# Altium schematic sheet Đồng Hồ_ Led 7 Thanh_ Duy bánh quy.SchDoc
size A3; SheetNumber: 1; SheetTotal: 4
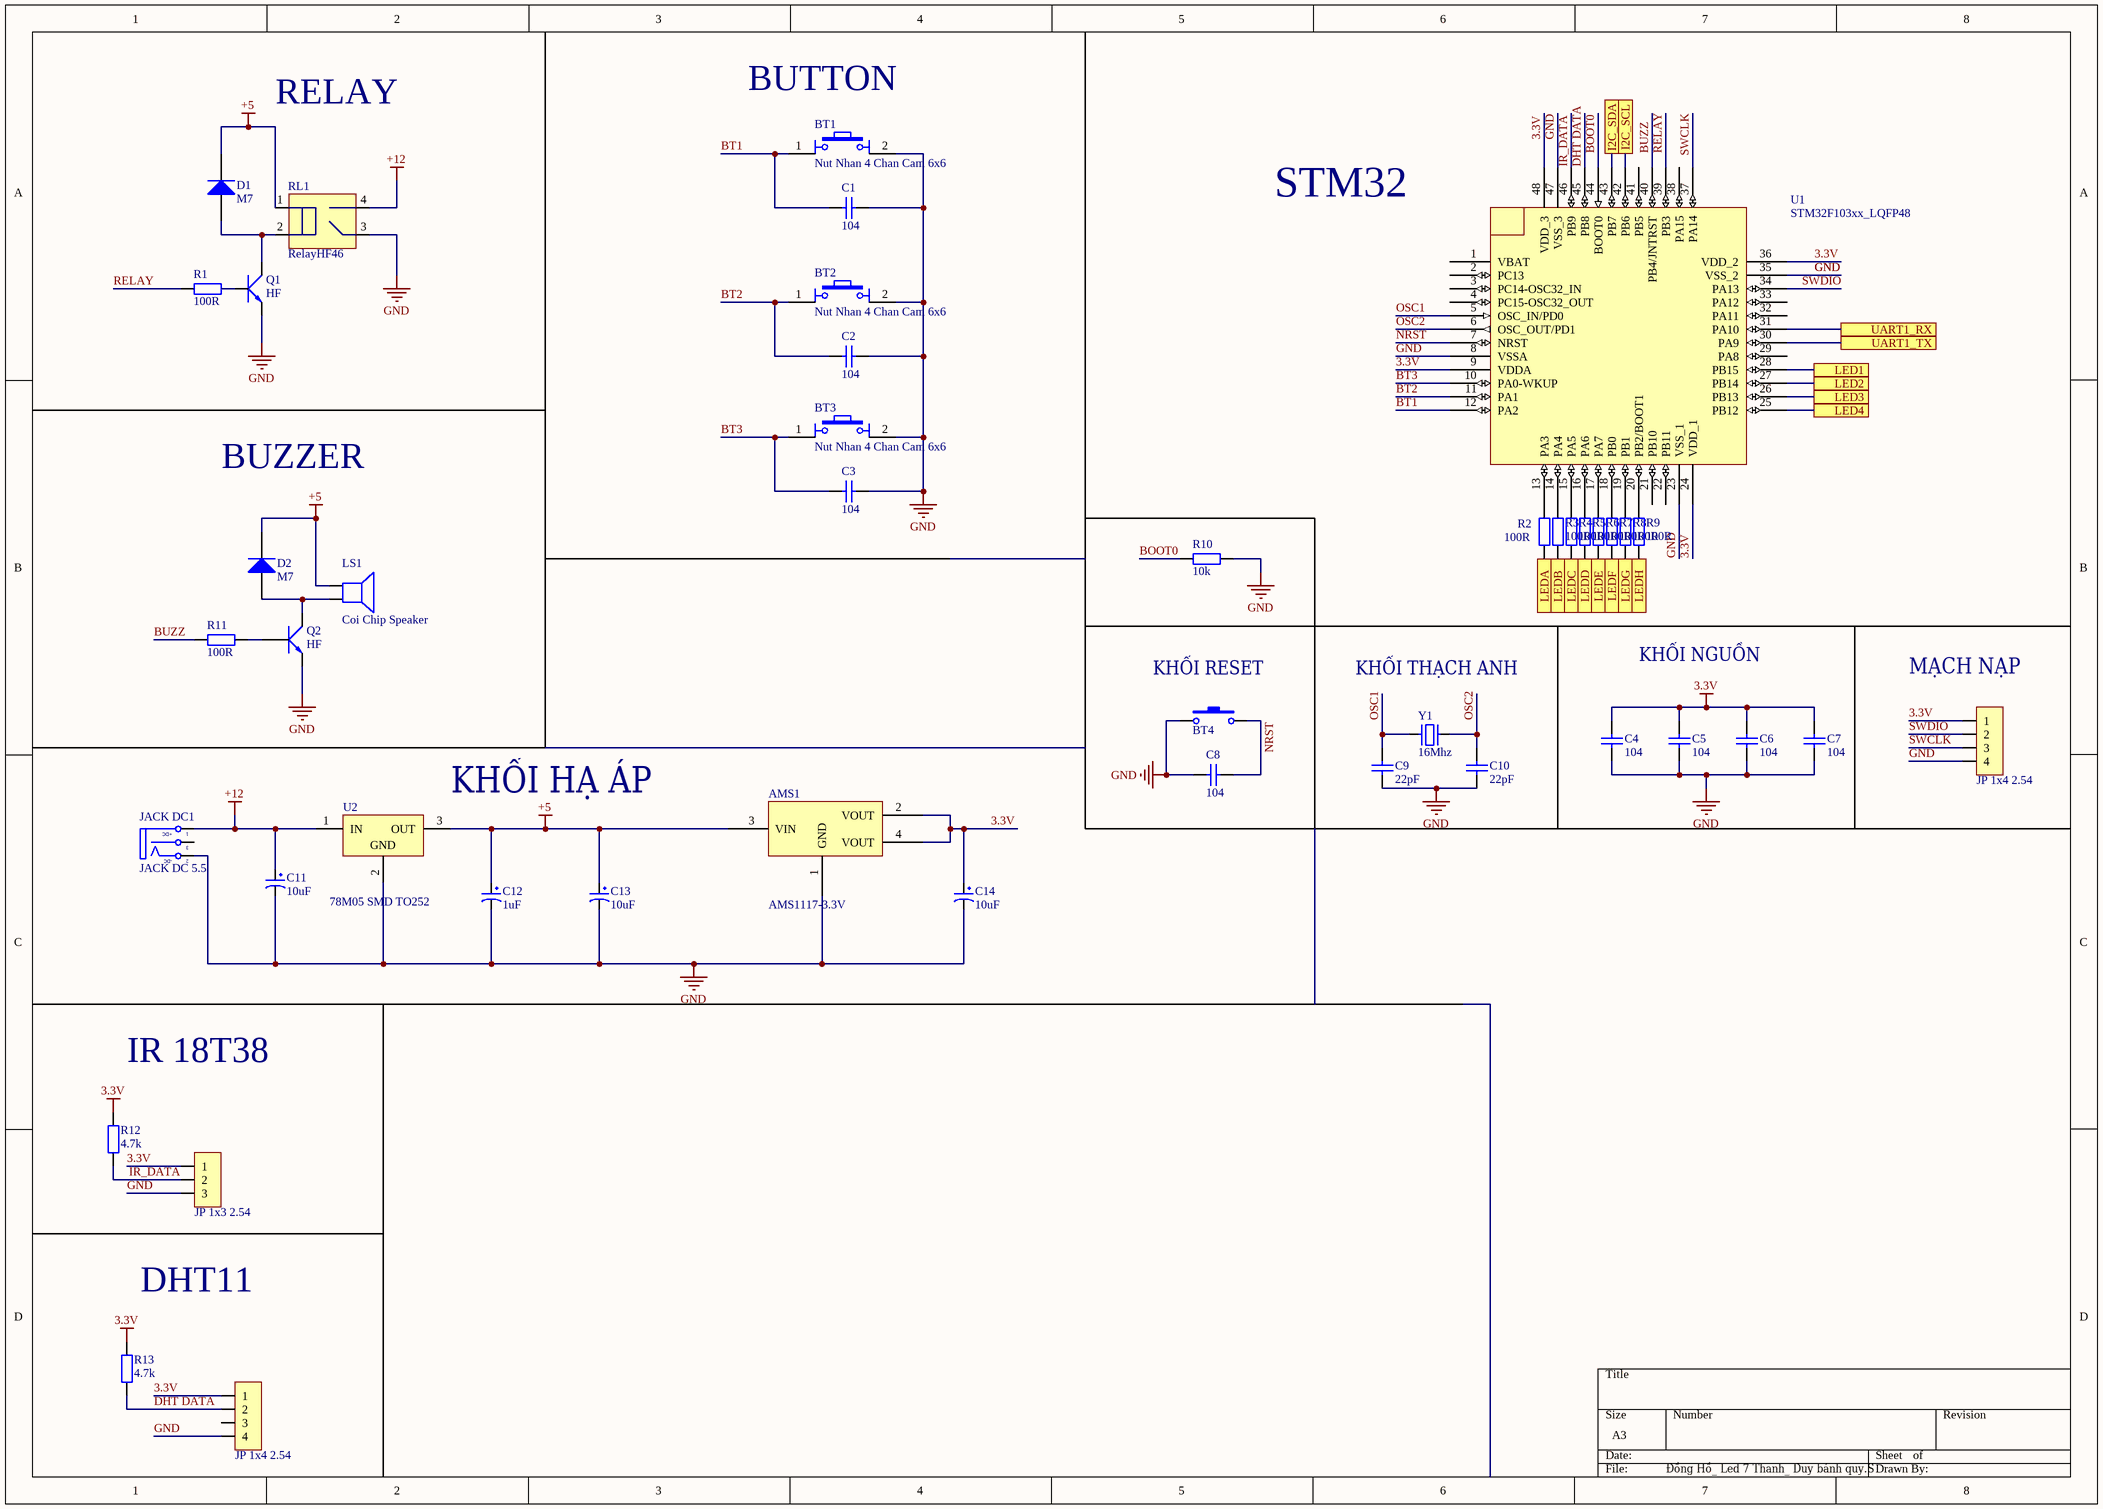
[diagram p0: Đồng Hồ_ Led 7 Thanh_ Duy bánh quy.SchDoc]

## Parts
AMS1  AMS1117-3.3V  [SOT223]
BT1  Nut Nhan 4 Chan Cam 6x6  [Nut Nhan 4 Chan Cam 6x6]
BT2  Nut Nhan 4 Chan Cam 6x6  [Nut Nhan 4 Chan Cam 6x6]
BT3  Nut Nhan 4 Chan Cam 6x6  [Nut Nhan 4 Chan Cam 6x6]
BT4  Nut Nhan 2 Chan SMD 3x6x2.5  [Nut Nhan 2 Chan SMD 3x6x2.5]  (value not drawn)
C1  104  [tu 0805]
C2  104  [tu 0805]
C3  104  [tu 0805]
C4  104  [tu 0805]
C5  104  [tu 0805]
C6  104  [tu 0805]
C7  104  [tu 0805]
C8  104  [tu 0805]
C9  22pF  [tu 0805]
C10  22pF  [tu 0805]
C11  10uF  [tu tantalum smd3216]
C12  1uF  [tu tantalum smd3216]
C13  10uF  [tu tantalum smd3216]
C14  10uF  [tu tantalum smd3216]
D1  M7  [DIODE SMA]
D2  M7  [DIODE SMA]
JACK_DC1  JACK DC 5.5  [JACK DC 5.5]
JP1  JP 1x4 2.54  [JP 1x4 DC]
JP2  JP 1x3 2.54  [JP 1x3 CT]
JP3  JP 1x4 2.54  [JP 1x4 CT]
LS1  Coi Chip Speaker  [Coi Chip Speacker]
Q1  HF  [SOT23]
Q2  HF  [SOT23]
R1  100R  [tro smd 0603]
R2  100R  [tro smd 0603]
R3  100R  [tro smd 0603]
R4  100R  [tro smd 0603]
R5  100R  [tro smd 0603]
R6  100R  [tro smd 0603]
R7  100R  [tro smd 0603]
R8  100R  [tro smd 0603]
R9  100R  [tro smd 0603]
R10  10k  [tro smd 0603]
R11  100R  [tro smd 0603]
R12  4.7k  [tro smd 0805]
R13  4.7k  [tro smd 0805]
RL1  RelayHF46  [Relay 4 chan HF46F]
U1  STM32F103xx_LQFP48  [STM32_LQPF48]
U2  78M05 SMD TO252  [TO252]
Y1  16Mhz  [Thach Anh 2 chan SMD]

## Ports
I2C_SCL, I2C_SDA, LED1, LED2, LED3, LED4, LEDA, LEDB, LEDC, LEDD, LEDE, LEDF, LEDG, LEDH, UART1_RX, UART1_TX

## Nets
3.3V: AMS1.2(VOUT) AMS1.4(VOUT) C4.1 C5.1 C6.1 C7.1 C14.1 JP1.1 JP2.1 JP3.1 R12.2 R13.2 U1.9(VDDA) U1.24(VDD_1) U1.36(VDD_2) U1.48(VDD_3)
+5: AMS1.3(VIN) C12.1 C13.1 D1.2(K) D2.2(K) LS1.1 RL1.1 U2.3(OUT)
+12: C11.1 JACK_DC1.1(T) RL1.4(AC/DC) U2.1(IN)
GND: AMS1.1(GND) BT1.2 BT2.2 BT3.2 BT4.1 C1.1 C2.1 C3.1 C4.2 C5.2 C6.2 C7.2 C8.2 C9.1 C10.1 C11.2 C12.2 C13.2 C14.2 JACK_DC1.2(TN) JP1.4 JP2.3 JP3.4 Q1.2(E) Q2.2(E) R10.2 RL1.3(AC/DC) U1.8(VSSA) U1.23(VSS_1) U1.35(VSS_2) U1.47(VSS_3) U2.2(GND)
BOOT0: R10.1 U1.44(BOOT0)
BT1: BT1.1 C1.2 U1.12(PA2)
BT2: BT2.1 C2.2 U1.11(PA1)
BT3: BT3.1 C3.2 U1.10(PA0-WKUP)
BUZZ: R11.1 U1.40(PB4/JNTRST)
DHT DATA: JP3.2 R13.1 U1.45(PB8)
I2C_SCL: U1.42(PB6) ; port I2C_SCL
I2C_SDA: U1.43(PB7) ; port I2C_SDA
IR_DATA: JP2.2 R12.1 U1.46(PB9)
LED1: U1.28(PB15) ; port LED1
LED2: U1.27(PB14) ; port LED2
LED3: U1.26(PB13) ; port LED3
LED4: U1.25(PB12) ; port LED4
LEDA: R2.1 ; port LEDA
LEDB: R3.1 ; port LEDB
LEDC: R4.1 ; port LEDC
LEDD: R5.1 ; port LEDD
LEDE: R6.1 ; port LEDE
LEDF: R7.1 ; port LEDF
LEDG: R8.1 ; port LEDG
LEDH: R9.1 ; port LEDH
NRST: BT4.2 C8.1 U1.7(NRST)
OSC1: C9.2 U1.5(OSC_IN/PD0) Y1.1
OSC2: C10.2 U1.6(OSC_OUT/PD1) Y1.2
RELAY: R1.1 U1.39(PB3)
SWCLK: JP1.3 U1.37(PA14)
SWDIO: JP1.2 U1.34(PA13)
UART1_RX: U1.31(PA10) ; port UART1_RX
UART1_TX: U1.30(PA9) ; port UART1_TX
NetD1_1: D1.1(A) Q1.3(C) RL1.2
NetD2_1: D2.1(A) LS1.2 Q2.3(C)
NetQ1_1: Q1.1(B) R1.2
NetQ2_1: Q2.1(B) R11.2
NetR2_2: R2.2 U1.13(PA3)
NetR3_2: R3.2 U1.14(PA4)
NetR4_2: R4.2 U1.15(PA5)
NetR5_2: R5.2 U1.16(PA6)
NetR6_2: R6.2 U1.17(PA7)
NetR7_2: R7.2 U1.18(PB0)
NetR8_2: R8.2 U1.19(PB1)
NetR9_2: R9.2 U1.20(PB2/BOOT1)

Not connected (* = marked no-connect by the designer): JACK_DC1 3(S); JP3 3; U1 1(VBAT) 2(PC13) 3(PC14-OSC32_IN) 4(PC15-OSC32_OUT) 21(PB10) 22(PB11) 29(PA8) 32(PA11) 33(PA12) 38(PA15) 41(PB5)

## Notes on the sheet
- RELAY
- BUTTON
- STM32
- BUZZER
- (near BT4) KHỐI RESET
- KHỐI THẠCH ANH
- KHỐI NGUỒN
- (near JP1) MẠCH NẠP
- (near U2) KHỐI HẠ ÁP
- IR 18T38
- DHT11
- (in symbol JACK DC 5.5) +DC; -DC

## Library data of the parts
AMS1 = AMS1117 SMD: Dán; Value: AMS1117-3.3V SOT223; Don_Vi: Con; Ma_Hang: MH000596; Ghi_Chu: *; Kieu_Chan: *; Chung_Loai: Dán
BT1-BT3 = Nut Nhan 4 Chan Cam 6x6: Nut Nhan 4 Chan 6x6mm; Ten: Nút Nhấn 4 Chân 6x6x5MM DIP; Ma_Hang: MH004584
BT4 = Nut Nhan 2 Chan SMD 3x6x2.5: Ma_Hang: MH001036; Ten: Nút Nhấn 2 Chân 3x6x2.5MM SMD
C1-C8 = Tu 0805 104 50V 10%: Dán; Don_Vi: Con; So_Chan: 2; Ten_Linh_Kien: Tụ 0805 104-100nF 10% 50V; Ma_Hang: MH004551; Chung_Loai: Dán; Kieu_Chan: *
C9 C10 = Tu 0805 22pF 50V 10%: Dán; Don_Vi: Con; So_Chan: 2; Ten_Linh_Kien: Tụ 0805 22P 10% 50V; Ma_Hang: MH004560; Chung_Loai: Dán; Kieu_Chan: *
C11 C13 C14 = Tu tantalum 10uF 16V SMD3216: Dán; Don_Vi: Con; So_Chan: 2; Ten_Linh_Kien: Tụ tantalum 106C-10uF 16V SMD3216; Ma_Hang: MH001954; Chung_Loai: Dán; Kieu_Chan: *
C12 = Tu tantalum 1uF 35V SMD3216: Dán; Don_Vi: Con; So_Chan: 2; Ten_Linh_Kien: Tụ tantalum 105V-1uF 35V SMD3216; Ma_Hang: MH007471; Chung_Loai: Dán; Kieu_Chan: *
D1 D2 = Diode M7 ( 4007 ): Dán; Don_Vi: Con; Ten_Linh_Kien: Diode M7 1N4007 SMD 1A 1000V; Ma_Hang: MH000944; Chung_Loai: Dán; Ghi_Chu: *
JACK_DC1 = JACK DC 5.5: Value: Jac DC
JP1 = JP 1x4 2.54 Duc Cong: Cắm; Ten_Linh_Kien: Jump Đơn Đực 2.54MM 1x40P Cong Đứng; Don_Vi: Con; Ma_Hang: MH000904; Ghi_Chu: *; Kieu_Chan: *; Chung_Loai: Cắm
JP2 = JP 1x3 2.54 Cai Thang: Cắm; Ten_Linh_Kien: Jump Đơn Cái 2.54MM 1x20P Thẳng; Don_Vi: Con; Ma_Hang: MH004006; Ghi_Chu: *; Kieu_Chan: *; Chung_Loai: Cắm
JP3 = JP 1x4 2.54 Cai Thang: Cắm; Ten_Linh_Kien: Jump Đơn Cái 2.54MM 1x20P Thẳng; Don_Vi: Con; Ma_Hang: MH004006; Ghi_Chu: *; Kieu_Chan: *; Chung_Loai: Cắm
LS1 = Coi Chip Speaker: Còi chip
Q1 Q2 = C1815 HF SMD: NPN transistor; Value: C9014
R1-R9 R11 = Tro 0603 5% 100R: Dán; Don_Vi: Con; So_Chan: 2; Ten_Linh_Kien: Trở 0603 5% 100R; Ma_Hang: MH006315; Chung_Loai: Dán; Kieu_Chan: *
R10 = Tro 0603 1% 10k: Dán; Don_Vi: Con; So_Chan: 2; Ten_Linh_Kien: Trở 0603 1% 10k; Ma_Hang: MH006333; Chung_Loai: Dán; Kieu_Chan: *
R12 R13 = Tro 0805 5% 4.7k: Dán; Don_Vi: Con; So_Chan: 2; Ten_Linh_Kien: Trở 0805 5% 4.7k; Ma_Hang: MH005307; Chung_Loai: Dán; Kieu_Chan: *
RL1 = Relay 4 chan HF46F: Ten: Relay 5V5A HF46F-G 5-HS1; Ma_Hang: MH003879
U2 = 78M05 SMD TO252: Dán; Don_Vi: Con; Ten_Linh_Kien: 78M05 TO252; Ma_Hang: MH001917; Ghi_Chu: *; Kieu_Chan: *; Chung_Loai: Dán
Y1 = Thach Anh 2 chan SMD: Crystal For all Crystal 2pin.; Value: 4Mhz
U1 = STM32F103xx_LQFP48: Published: 30-May-2008; DatasheetVersion: rev6, Mar-2008; PackageVersion: Mar-2008; PackageReference: LQFP48; Publisher: Altium Limited; PackageDescription: 48-Pin Low-Profile Quad Flat Pack, 7 x 7 mm Body, 0.5 mm Pitch (LQFP48); ComponentLink1Description: Manufacturer Link; ComponentLink1URL: www.st.com/stm32; ComponentLink2Description: Datasheet; ComponentLink2URL: http://www.st.com/stonline/products/literature/ds/13587.pdf